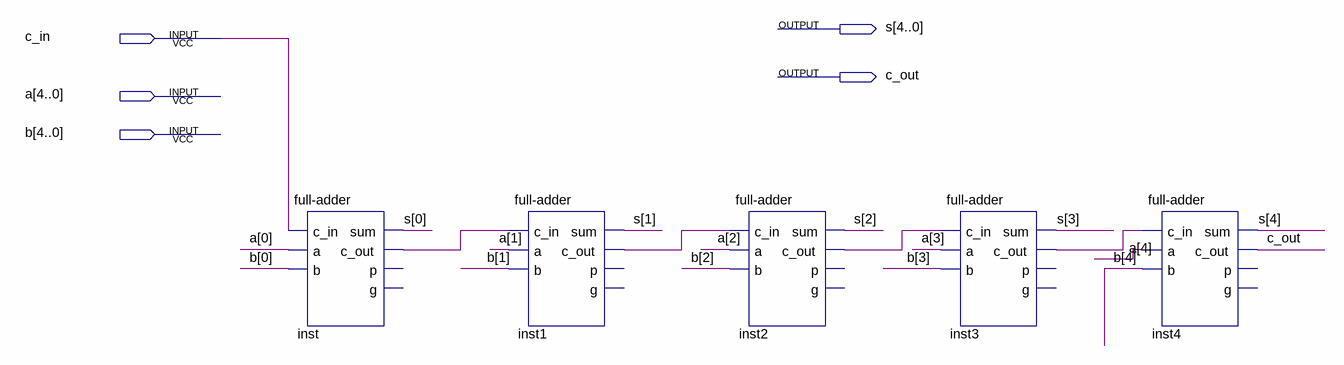
[diagram p0: schematic sheet]
// Quartus schematic cselecta_fifth_two.bdf as structural Verilog: 5 symbols, 5 pins
module cselecta_fifth_two (
  input  c_in,
  input  [4:0] a,
  input  [4:0] b,
  output [4:0] s,
  output c_out
);

  wire inst1_c_out, inst2_c_out, inst3_c_out, inst_c_out;

  \full-adder  inst (.c_in(c_in), .a(a[0]), .b(b[0]), .sum(s[0]), .c_out(inst_c_out));  // open: p, g
  \full-adder  inst1 (.c_in(inst_c_out), .a(a[1]), .b(b[1]), .sum(s[1]), .c_out(inst1_c_out));  // open: p, g
  \full-adder  inst2 (.c_in(inst1_c_out), .a(a[2]), .b(b[2]), .sum(s[2]), .c_out(inst2_c_out));  // open: p, g
  \full-adder  inst3 (.c_in(inst2_c_out), .a(a[3]), .b(b[3]), .sum(s[3]), .c_out(inst3_c_out));  // open: p, g
  \full-adder  inst4 (.c_in(inst3_c_out), .a(a[4]), .b(b[4]), .sum(s[4]), .c_out(c_out));  // open: p, g
endmodule
